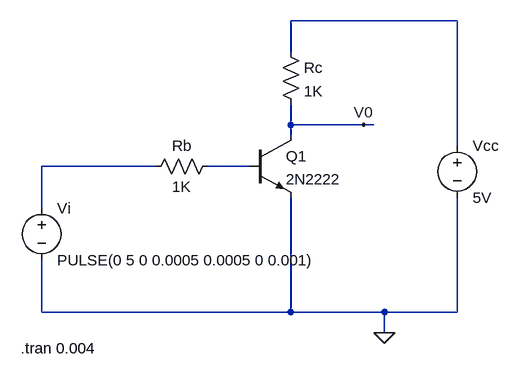
[diagram p0: schematic 1.2.2.asc]
1.2.2.asc, the LTspice schematic file:
Version 4
SHEET 1 880 680
WIRE 496 -80 240 -80
WIRE 240 -32 240 -80
WIRE 240 80 240 48
WIRE 352 80 240 80
WIRE 368 80 352 80
WIRE 240 96 240 80
WIRE 496 112 496 -80
WIRE 32 144 -144 144
WIRE 176 144 112 144
WIRE -144 208 -144 144
WIRE -144 368 -144 288
WIRE 240 368 240 192
WIRE 240 368 -144 368
WIRE 384 368 240 368
WIRE 496 368 496 192
WIRE 496 368 384 368
WIRE 384 400 384 368
FLAG 384 400 0
FLAG 352 80 V0
SYMBOL npn 176 96 R0
SYMATTR InstName Q1
SYMATTR Value 2N2222
SYMBOL res 224 -48 R0
SYMATTR InstName Rc
SYMATTR Value 1K
SYMBOL res 128 128 R90
WINDOW 0 0 56 VBottom 2
WINDOW 3 32 56 VTop 2
SYMATTR InstName Rb
SYMATTR Value 1K
SYMBOL voltage -144 192 R0
WINDOW 123 0 0 Left 0
WINDOW 39 0 0 Left 0
SYMATTR InstName Vi
SYMATTR Value PULSE(0 5 0 0.0005 0.0005 0 0.001)
SYMBOL voltage 496 96 R0
SYMATTR InstName Vcc
SYMATTR Value 5V
TEXT -176 424 Left 2 !.tran 0.004

The netlist it stands for:
* 1.2.2.asc
Q1 V0 N003 0 0 2N2222
Rc N001 V0 1K
Rb N003 N002 1K
Vi N002 0 PULSE(0 5 0 0.0005 0.0005 0 0.001)
Vcc N001 0 5V
.model NPN NPN
.model PNP PNP
.lib standard.bjt
.tran 0.004
.backanno
.end